# Altium schematic sheet TPSM82822_2A_Buck_Module.SchDoc: +3V3 Output DC-DC Converter
size A4
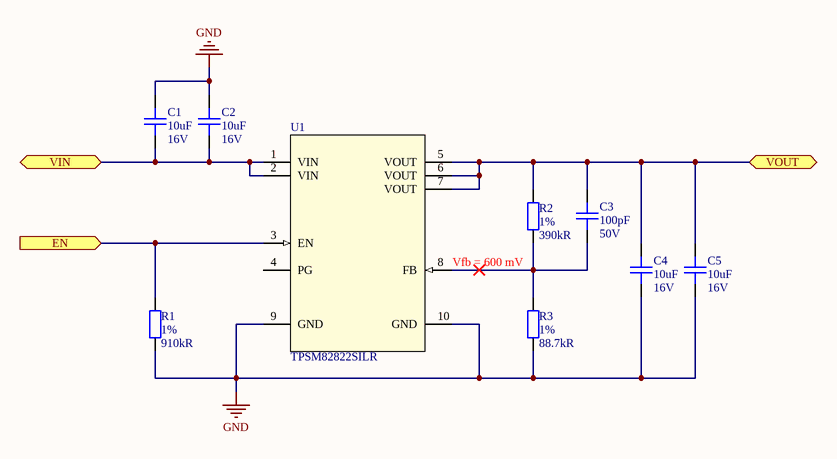
[diagram p0: TPSM82822_2A_Buck_Module.SchDoc]

## Parts
C1  Capacitance: 10uF  Voltage Rating: 16V  [CAPC1608X08N_0603]  (hidden comment: CAP CER 10UF 16V X5R 0603)
C2  Capacitance: 10uF  Voltage Rating: 16V  [CAPC1608X08N_0603]  (hidden comment: CAP CER 10UF 16V X5R 0603)
C3  Capacitance: 100pF  Voltage: 50V  [C0402]  (hidden comment: CAP CER 100PF 50V C0G/NPO 0402)
C4  Capacitance: 10uF  Voltage Rating: 16V  [CAPC1608X08N_0603]  (hidden comment: CAP CER 10UF 16V X5R 0603)
C5  Capacitance: 10uF  Voltage Rating: 16V  [CAPC1608X08N_0603]  (hidden comment: CAP CER 10UF 16V X5R 0603)
R1  Tolerance: 1%  Resistance: 910kR  [R_0402]  (hidden comment: RES SMD 910K OHM 1% 1/16W 0402)
R2  Tolerance: 1%  Resistance: 390kR  [R0402]  (hidden comment: RES SMD 390K OHM 1% 1/16W 0402)
R3  Tolerance: 1%  Resistance: 88.7kR  [0402R]  (hidden comment: RES SMD 88.7K OHM 1% 1/16W 0402)
U1  TPSM82822SILR  [SIL0010D]

## Ports
EN (in), VIN, VOUT

## Nets
GND: C1.2 C2.2 C4.2 C5.2 R1.2 R3.2 U1.9(GND) U1.10(GND)
EN: R1.1 U1.3(EN) ; port EN
VIN: C1.1 C2.1 U1.1(VIN) U1.2(VIN) ; port VIN
VOUT: C3.2 C4.1 C5.1 R2.2 U1.5(VOUT) U1.6(VOUT) U1.7(VOUT) ; port VOUT
NetC3_1: C3.1 R2.1 R3.1 U1.8(FB)

Not connected (* = marked no-connect by the designer): U1 4(PG)

## Notes on the sheet
- Vfb = 600 mV
- Title
- Size:
- Date:
- A4
- Number:
- Time:
- Revision:
- Sheet
- of
- File:

## Library data of the parts
C1 C2 C4 C5 = CAP CER 10UF 16V X5R 0603: 10µF ±10% 16V Ceramic Capacitor X5R 0603 (1608 Metric); Manufacturer: Murata; Manufacturer Part Number: GRM188R61C106KAALJ; Supplier 1: Digi-Key; Stock 1: 5470; Pricing 1: 1=0.39, 10=0.271, 100=0.1628, 500=0.1221, 1000=0.1031, 2500=0.0977, 5000=0.0923 (USD); Mount: Surface Mount; Case/Package: 0603; Case Code (Metric): 1608; Case Code (Imperial): 0603; Min Operating Temperature: -55°C; Max Operating Temperature: 85°C; Packaging: Tape and Reel; Tolerance: 10%; Voltage Rating (DC): 16V; Dielectric: X5R; Termination: SMD/SMT; Package Quantity: 10000; Length: 0.063inch; Height: 0.8mm; Width: 0.031inch; Thickness: 0.037inch; Supplier Part Number 1: 490-12736-1-ND; Weight: 0.000222oz; Composition: Ceramic
C3 = CAP CER 100PF 50V C0G/NPO 0402: 100pF ±5% 50V Ceramic Capacitor C0G, NP0 0402 (1005 Metric); Manufacturer: Yageo; Manufacturer Part Number: CC0402JRNPO9BN101; Insulation Resistance: 100GR; Temperature Coefficient: 30ppm/°C; Supplier 1: Digi-Key; Stock 1: 3017640; Pricing 1: 1=0.1, 10=0.02, 100=0.0089, 500=0.0064, 1000=0.005, 2500=0.0046, 5000=0.0042 (USD); Mount: Surface Mount; Case Code (Metric): 1005; Case Code (Imperial): 0402; Min Operating Temperature: -55°C; Max Operating Temperature: 125°C; Tolerance: 5%; Dielectric: C0G; Voltage Rating (DC): 50V; Packaging: Tape and Reel; Voltage Rating: 50V; Package Quantity: 1; Termination: SMD/SMT; Length: 1mm; Height: 0.5mm; Depth: 0.5mm; Width: 0.5mm; Thickness: 0.022inch; Radiation Hardening: No; REACH SVHC: No SVHC; Lead Free: Lead Free; ComponentLink1URL: http://www.farnell.com/datasheets/2213336.pdf?src-supplier=Newark; ComponentLink1Description: http://www.farnell.com/datasheets/2213336.pdf?src-supplier=Newark; ComponentLink2URL: http://www.yageo.com/documents/recent/UPY-GP_NP0_16V-to-50V_16.pdf?src-supplier=Digi-Key; ComponentLink2Description: http://www.yageo.com/documents/recent/UPY-GP_NP0_16V-to-50V_16.pdf?src-supplier=Digi-Key; ComponentLink3URL: http://documents.rs-components.com/techlib://itc_doclist_GB.htm?stockno=6698684&src-supplier=RSComponents; ComponentLink3Description: http://documents.rs-components.com/techlib://itc_doclist_GB.htm?stockno=6698684&src-supplier=RSComponents; ComponentLink4URL: http://www.yageo.com/documents/recent/UPY-GP_NP0_16V-to-50V_8.pdf?src-supplier=Avnet+Europe; ComponentLink4Description: http://www.yageo.com/documents/recent/UPY-GP_NP0_16V-to-50V_8.pdf?src-supplier=Avnet+Europe; Supplier Part Number 1: 311-1024-6-ND; Case/Package: 0402; Number of Pins: 2; Dielectric Material: Ceramic; Composition: Ceramic; ComponentLink5URL: http://www.farnell.com/datasheets/1443161.pdf?src-supplier=Element14; ComponentLink5Description: http://www.farnell.com/datasheets/1443161.pdf?src-supplier=Element14; ComponentLink6URL: http://www.farnell.com/datasheets/2213336.pdf?src-supplier=Element14; ComponentLink6Description: http://www.farnell.com/datasheets/2213336.pdf?src-supplier=Element14
R1 = RES SMD 910K OHM 1% 1/16W 0402: 910 kOhms ±1% 0.063W, 1/16W Chip Resistor 0402 (1005 Metric) Moisture Resistant Thick Film; Manufacturer: Yageo; Manufacturer Part Number: RC0402FR-07910KL; Power Rating: 62.5mW; Voltage Rating: 50V; Temperature Coefficient: 100ppm/°C; Max Power Dissipation: 63mW; Supplier 1: Digi-Key; Stock 1: 96210; Pricing 1: 1=0.1, 10=0.015, 100=0.0062, 1000=0.0028, 2500=0.0024, 5000=0.002 (USD); Case/Package: 0402; Case Code (Imperial): 0402; Case Code (Metric): 1005; Contact Plating: Tin,Matte; Min Operating Temperature: -55°C; Max Operating Temperature: 155°C; Packaging: Tape and Reel; Composition: Thick Film; Termination: SMD/SMT; Number of Terminations: 2; Military Standard: Not; Voltage Rating (DC): 50V; Features: Moisture Resistant; Length: 1mm; Height: 0.016inch; Width: 0.5mm; Depth: 0.5mm; REACH SVHC: Unknown; Lead Free: Lead Free; ComponentLink1URL: http://www.yageo.com/documents/recent/PYu-RC0402_51_RoHS_L_6.pdf?src-supplier=Avnet+Europe; ComponentLink1Description: http://www.yageo.com/documents/recent/PYu-RC0402_51_RoHS_L_6.pdf?src-supplier=Avnet+Europe; ComponentLink2URL: https://www.verical.com/server-webapp/html/getDatasheet?partID=741075&src-supplier=Verical; ComponentLink2Description: https://www.verical.com/server-webapp/html/getDatasheet?partID=741075&src-supplier=Verical; ComponentLink3URL: http://www.yageo.com/documents/recent/PYu-RC0402_51_RoHS_L_6.pdf?src-supplier=Avnet; ComponentLink3Description: http://www.yageo.com/documents/recent/PYu-RC0402_51_RoHS_L_6.pdf?src-supplier=Avnet; Supplier Part Number 1: YAG3257CT-ND
R2 = RES SMD 390K OHM 1% 1/16W 0402: 390 kOhms ±1% 0.063W, 1/16W Chip Resistor 0402 (1005 Metric) Moisture Resistant Thick Film; Manufacturer: Yageo; Manufacturer Part Number: RC0402FR-07390KL; Power Rating: 62.5mW; Voltage Rating: 50V; Temperature Coefficient: 100ppm/°C; Max Power Dissipation: 63mW; Supplier 1: Digi-Key; Case Code (Metric): 1005; Case Code (Imperial): 0402; Composition: Thick Film; Length: 1mm; Height: 0.016inch; Width: 0.02inch; Depth: 0.5mm; Lead Free: Lead Free; Supplier Part Number 1: YAG3143CT-ND; Case/Package: 0402; Stock 1: 118017; Pricing 1: 1=0.1, 10=0.016, 100=0.0064, 1000=0.0029, 2500=0.0025, 5000=0.0021 (USD); Min Operating Temperature: -55°C; Max Operating Temperature: 155°C; Packaging: Tape and Reel; Termination: SMD/SMT; Military Standard: Not; ComponentLink1URL: http://www.yageo.com/documents/recent/PYu-RC0402_51_RoHS_L_6.pdf?src-supplier=Future+Electronics; ComponentLink1Description: http://www.yageo.com/documents/recent/PYu-RC0402_51_RoHS_L_6.pdf?src-supplier=Future+Electronics; ComponentLink2URL: http://www.farnell.com/datasheets/2167052.pdf?src-supplier=Element14; ComponentLink2Description: http://www.farnell.com/datasheets/2167052.pdf?src-supplier=Element14; ComponentLink3URL: http://www.mouser.com/ds/2/447/PYu-RC0402_51_RoHS_L_6_r-8721.pdf?src-supplier=Mouser; ComponentLink3Description: http://www.mouser.com/ds/2/447/PYu-RC0402_51_RoHS_L_6_r-8721.pdf?src-supplier=Mouser; Weight: 2.3E-05oz; Number of Terminations: 2; Features: Moisture Resistant; REACH SVHC: Unknown
R3 = RES SMD 88.7K OHM 1% 1/16W 0402: 88.7 kOhms ±1% 0.063W, 1/16W Chip Resistor 0402 (1005 Metric) Moisture Resistant Thick Film; Manufacturer: Yageo; Manufacturer Part Number: RC0402FR-0788K7L; Power Rating: 62.5mW; Voltage Rating: 50V; Temperature Coefficient: 100ppm/°C; Supplier 1: Digi-Key; Case Code (Metric): 1005; Case Code (Imperial): 0402; Composition: Thick Film; Length: 1mm; Height: 0.35mm; Width: 0.5mm; Depth: 0.5mm; Lead Free: Lead Free; Supplier Part Number 1: 311-88.7KLRCT-ND; Case/Package: 0402; Stock 1: 136150; Pricing 1: 1=0.1, 10=0.016, 100=0.0064, 1000=0.0029, 2500=0.0025, 5000=0.0021 (USD); Min Operating Temperature: -55°C; Max Operating Temperature: 155°C; Packaging: Tape and Reel; Termination: SMD/SMT; Military Standard: Not; ComponentLink1URL: http://www.yageo.com/documents/recent/PYu-RC0402_51_RoHS_L_6.pdf?src-supplier=Avnet+Europe; ComponentLink1Description: http://www.yageo.com/documents/recent/PYu-RC0402_51_RoHS_L_6.pdf?src-supplier=Avnet+Europe; ComponentLink2URL: http://www.yageo.com/documents/recent/PYu-RC0402_51_RoHS_L_6_r.pdf?src-supplier=Future+Electronics; ComponentLink2Description: http://www.yageo.com/documents/recent/PYu-RC0402_51_RoHS_L_6_r.pdf?src-supplier=Future+Electronics; ComponentLink3URL: http://www.yageo.com/documents/recent/PYu-RC0402_51_RoHS_L_6.pdf?src-supplier=Avnet; ComponentLink3Description: http://www.yageo.com/documents/recent/PYu-RC0402_51_RoHS_L_6.pdf?src-supplier=Avnet; Contact Plating: Tin,Matte; Voltage Rating (DC): 50V
U1 = IC TPSM82822SIL 5.5-V INPUT, 2-A STEP-DOWN MODUL: Non-Isolated PoL Module DC DC Converter 1 Output 0.6 ~ 4V    2A 2.4V - 5.5V Input; Manufacturer: Texas Instruments; ComponentLink1URL: https://octopart.com/click/track?ai=10049&ct=datasheets&sig=01db677&at=physicalpart&sid=370&ppid=108054084&hlid=30259078&src-supplier=TI+store; ComponentLink1Description: https://octopart.com/click/track?ai=10049&ct=datasheets&sig=01db677&at=physicalpart&sid=370&ppid=108054084&hlid=30259078&src-supplier=TI+store; Supplier 1: Digi-Key; Manufacturer Part Number: TPSM82822SILR; Stock 1: 2595; Pricing 1: 1=2.81, 10=2.523, 25=2.3848, 100=1.961, 250=1.7596, 500=1.696, 1000=1.4098 (USD); Supplier Part Number 1: 296-TPSM82822SILRCT-ND